# Altium project Frost5000Beta.PrjPcb
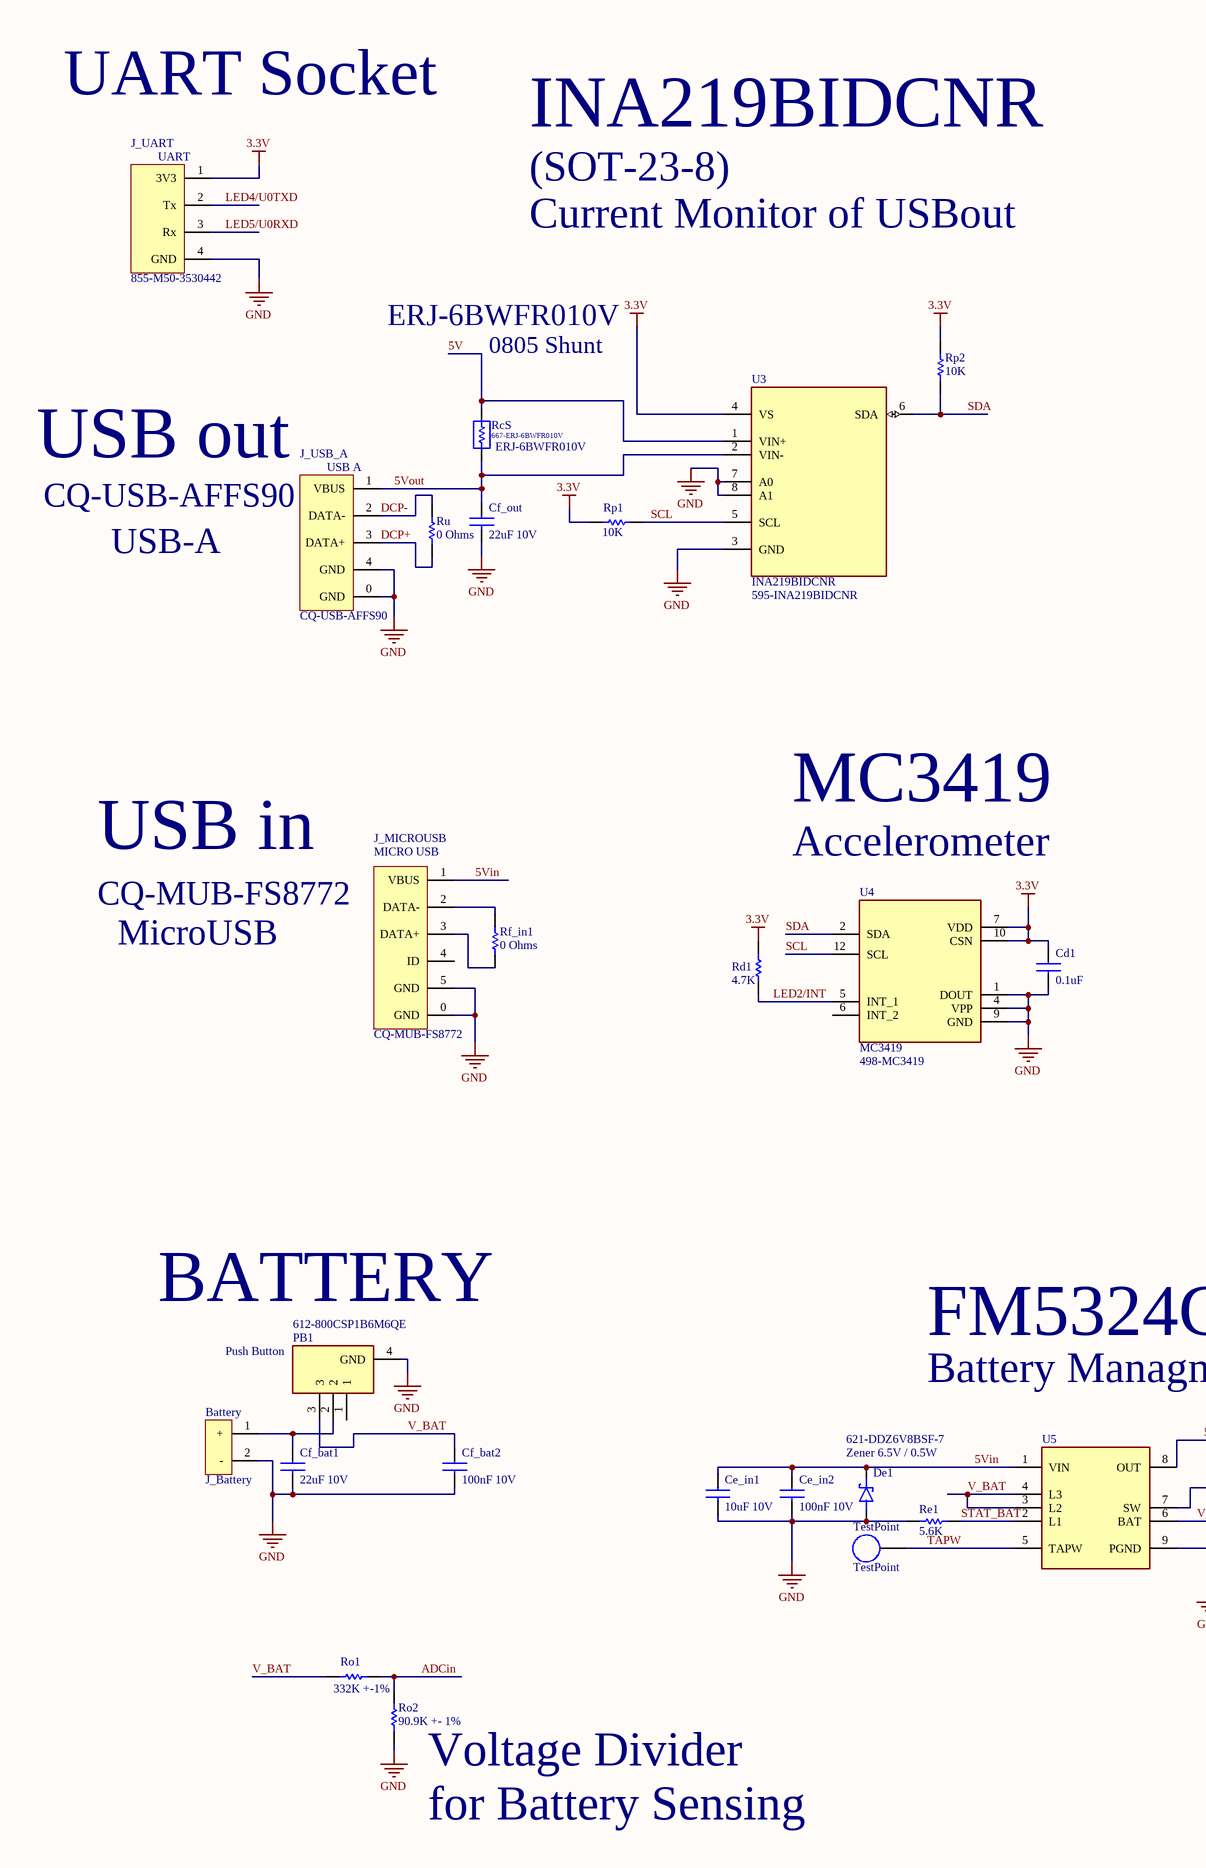
[diagram p0: Frost5000Beta_Sch.SchDoc, left]
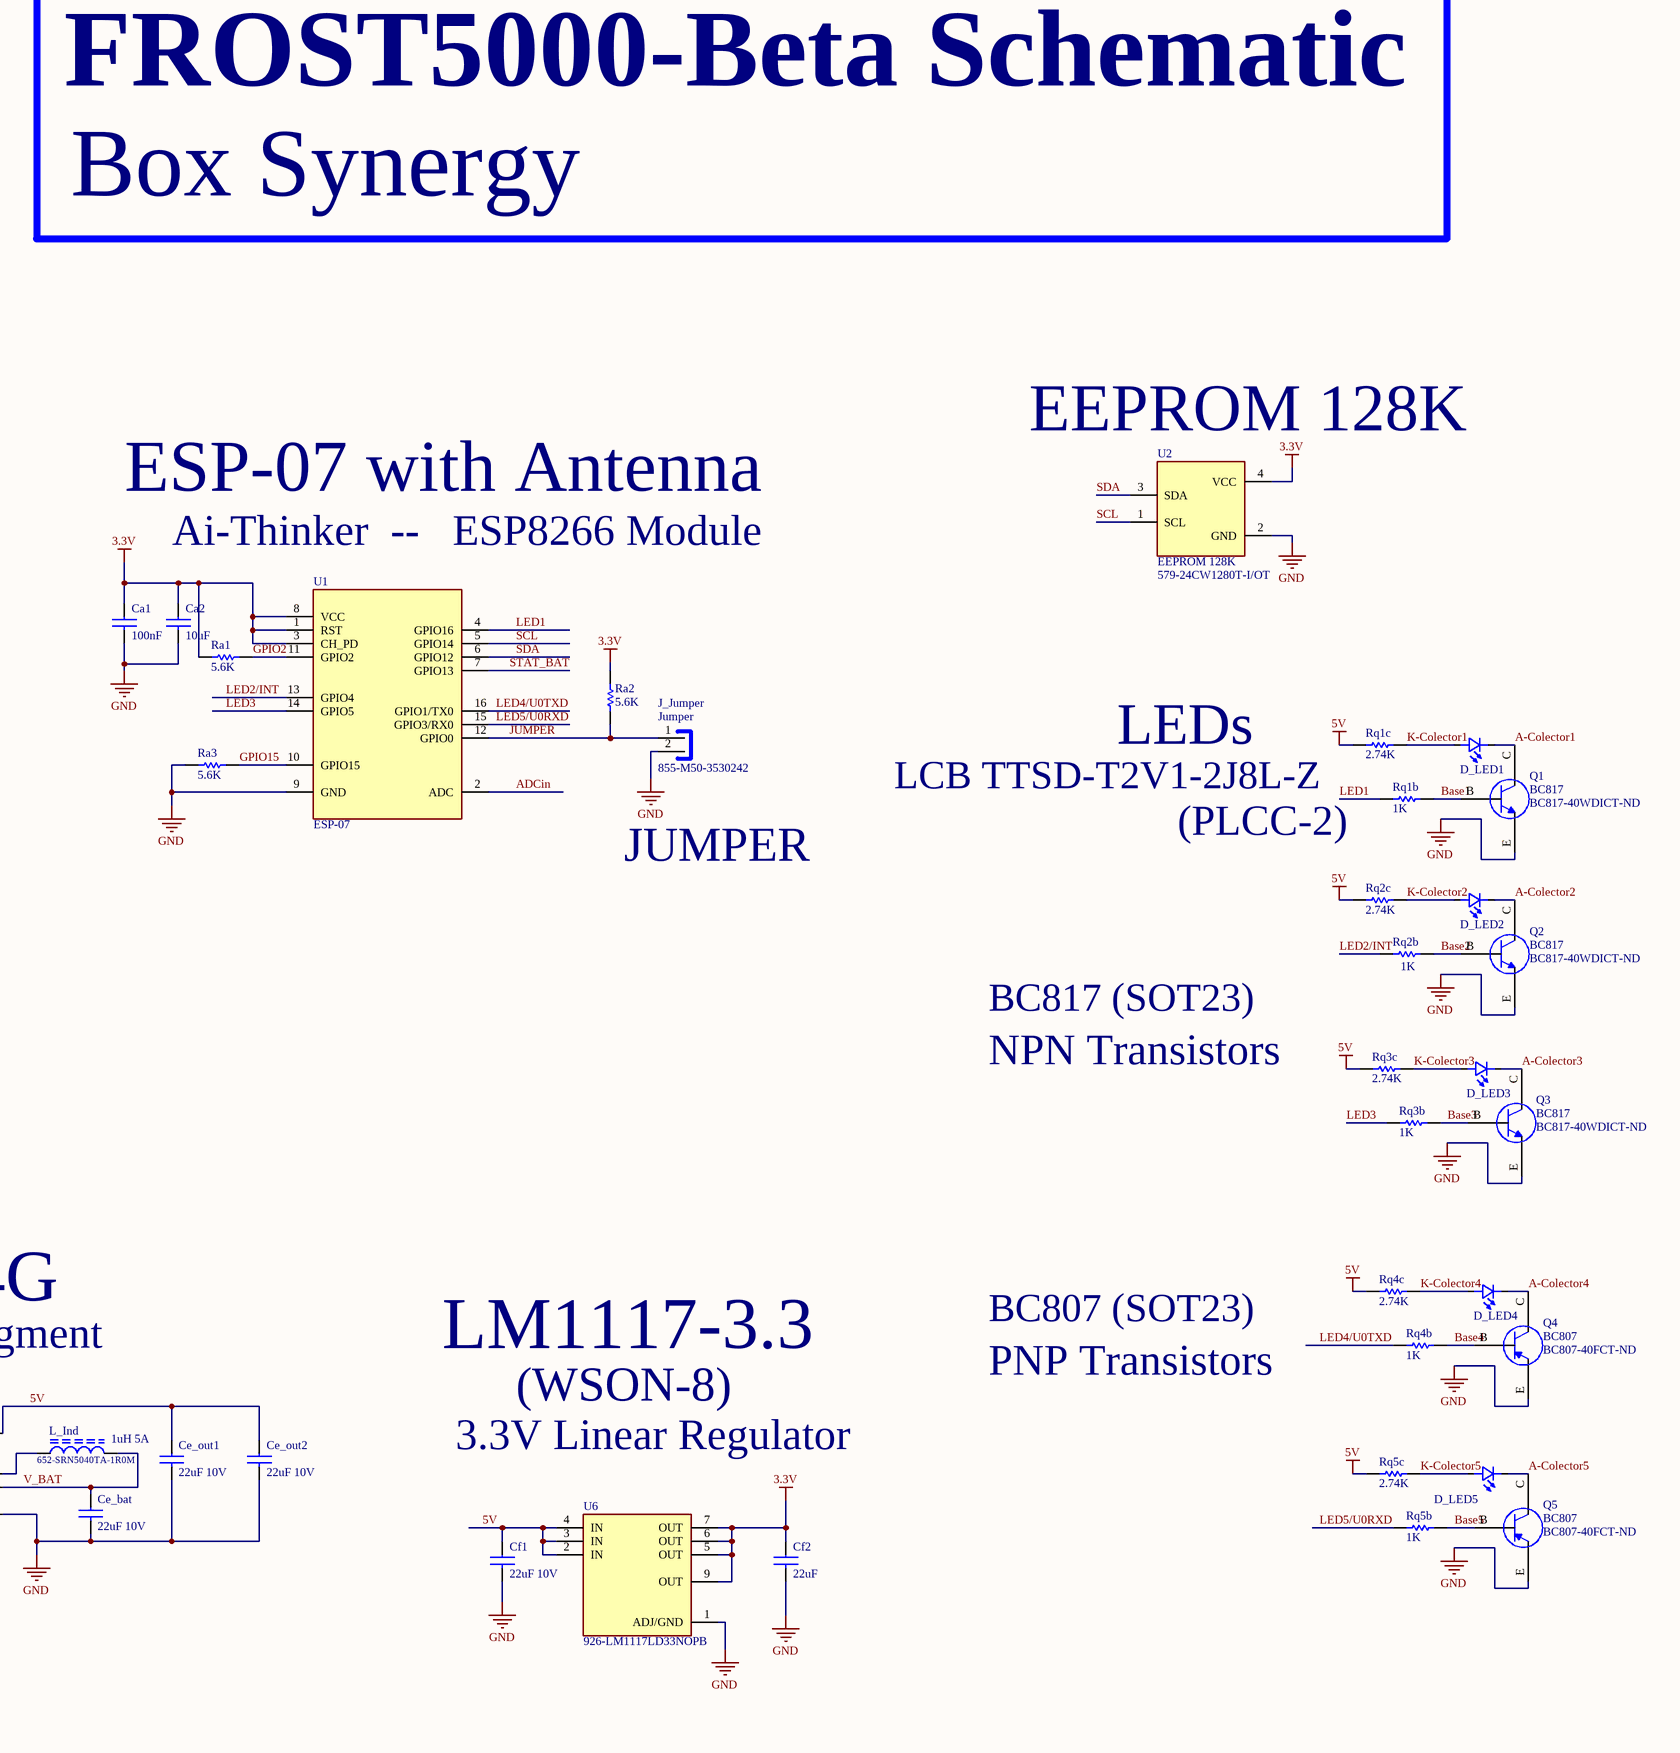
[diagram p1: Frost5000Beta_Sch.SchDoc, right]
1 sheet, 60 parts. Net scope: global (net labels, ports and power ports of the same name join across sheets).
Board file: Frost5000Beta_PCB.PcbDoc

## Sheet Frost5000Beta_Sch.SchDoc: Frost5000 Beta - V2.1
size A2; CheckedBy: Gonzalo Salinas; Author: Gustavo Belbruno; CompanyName: Box Synergy; DrawnBy: Gustavo Belbruno; Engineer: Gustavo Belbruno; Address4: Box Synergy; DocumentNumber: 2; Revision: 2.1; SheetNumber: 1; SheetTotal: 1

### Parts
Ca1  100nF  [CAP_0603]
Ca2  10uF  [CAP_1206]
Cd1  0.1uF  [CAP_0603]
Ce_bat  22uF 10V  [CAP_1206]
Ce_in1  10uF 10V  [CAP_1206]
Ce_in2  100nF 10V  [CAP_0603]
Ce_out1  22uF 10V  [CAP_1210]
Ce_out2  22uF 10V  [CAP_1206]
Cf1  22uF 10V  [CAP_0603]
Cf2  22uF  [CAP_0603]
Cf_bat1  22uF 10V  [CAP_1206]
Cf_bat2  100nF 10V  [CAP_0603]
Cf_out  22uF 10V  [CAP_1210]
D_LED1  LCB TTSD-T2V1-2J8L-Z  [LED_PLCC-2]  (value not drawn)
D_LED2  LCB TTSD-T2V1-2J8L-Z  [LED_PLCC-2]  (value not drawn)
D_LED3  LCB TTSD-T2V1-2J8L-Z  [LED_PLCC-2]  (value not drawn)
D_LED4  LCB TTSD-T2V1-2J8L-Z  [LED_PLCC-2]  (value not drawn)
D_LED5  LCB TTSD-T2V1-2J8L-Z  [LED_PLCC-2]  (value not drawn)
De1  Zener 6.5V / 0.5W  Supplier Part Number 1: 621-DDZ6V8BSF-7  [Zener-SOD323F]
J_Battery  Connx2_Battery  [Battery]  (value not drawn)
J_Jumper  Supplier Part Number 1: 855-M50-3530242  [JUMPER-1.27 mm]  (hidden comment: M50-3530242)
J_MICROUSB  CQ-MUB-FS8772  [MICRO USB]
J_UART  Supplier Part Number 1: 855-M50-3530442  [UART-1.27mm]  (hidden comment: M50-3530442)
J_USB_A  CQ-USB-AFFS90  [USB-A__IPX8]
L_Ind  1uH 5A  Supplier Part Number 1: 652-SRN5040TA-1R0M  [Inductor_SRN5040]
PB1  Push Button  Supplier Part Number 1: 612-800CSP1B6M6QE  [800C Switch]
Q1  BC817  Supplier Part Number 1: BC817-40WDICT-ND  [Transistor_SOT23-3]
Q2  BC817  Supplier Part Number 1: BC817-40WDICT-ND  [Transistor_SOT23-3]
Q3  BC817  Supplier Part Number 1: BC817-40WDICT-ND  [Transistor_SOT23-3]
Q4  BC807  Supplier Part Number 1: BC807-40FCT-ND  [Transistor_SOT23-3]
Q5  BC807  Supplier Part Number 1: BC807-40FCT-ND  [Transistor_SOT23-3]
Ra1  5.6K  [RES_0603]
Ra2  5.6K  [RES_0603]
Ra3  5.6K  [RES_0603]
RcS  ERJ-6BWFR010V  Supplier Part Number 1: 667-ERJ-6BWFR010V  [RES-SHUNT-0805]
Rd1  4.7K  [RES_0603]
Re1  5.6K  [RES_0603]
Rf_in1  0 Ohms  [RES_0603]
Ro1  332K +-1%  [RES_0603]
Ro2  90.9K +- 1%  [RES_0603]
Rp1  10K  [RES_0603]
Rp2  10K  [RES_0603]
Rq1b  1K  [RES_0603]
Rq1c  2.74K  [RES_0603]
Rq2b  1K  [RES_0603]
Rq2c  2.74K  [RES_0603]
Rq3b  1K  [RES_0603]
Rq3c  2.74K  [RES_0603]
Rq4b  1K  [RES_0603]
Rq4c  2.74K  [RES_0603]
Rq5b  1K  [RES_0603]
Rq5c  2.74K  [RES_0603]
Ru  0 Ohms  [RES_0603]
TestPoint  TestPoint  [TestPoint]  (no BOM)
U1  ESP-07  [ESP-07]
U2  EEPROM 128K  Supplier Part Number 1: 579-24CW1280T-I/OT  [24CW128]
U3  INA219BIDCNR  Supplier Part Number 1: 595-INA219BIDCNR  [INA219B SOT23]
U4  MC3419  Supplier Part Number 1: 498-MC3419  [MC3419]
U5  FM5324G  [SOP8]  (value not drawn)
U6  Supplier Part Number 1: 926-LM1117LD33NOPB  [LM1117-3.3-WSON-8]  (hidden comment: LM1117LD-3.3/NOPB)

### Nets
3.3V: Ca1.1 Ca2.1 Cd1.1 Cf2.1 J_UART.1(3V3) Ra1.2 Ra2.2 Rd1.1 Rp1.1 Rp2.1 U1.1(RST) U1.3(CH_PD) U1.8(VCC) U2.4(VCC) U3.4(VS) U4.7(VDD) U4.10(CSN) U6.5(OUT) U6.6(OUT) U6.7(OUT) U6.9(OUT)
5V: Ce_out1.1 Ce_out2.1 Cf1.1 RcS.2 Rq1c.2 Rq2c.2 Rq3c.2 Rq4c.2 Rq5c.2 U3.1(VIN+) U5.8(OUT) U6.2(IN) U6.3(IN) U6.4(IN)
GND: Ca1.2 Ca2.2 Cd1.2 Ce_bat.2 Ce_in1.2 Ce_in2.2 Ce_out1.2 Ce_out2.2 Cf1.2 Cf2.2 Cf_bat1.2 Cf_bat2.2 Cf_out.2 De1.A J_Battery.2(-) J_Jumper.2 J_MICROUSB.0(GND) J_MICROUSB.5(GND) J_UART.4(GND) J_USB_A.0(GND) J_USB_A.4(GND) PB1.4(GND) Q1.E Q2.E Q3.E Q4.E Q5.E Ra3.2 Re1.2 Ro2.1 U1.9(GND) U2.2(GND) U3.3(GND) U3.7(A0) U3.8(A1) U4.1(DOUT) U4.4(VPP) U4.9(GND) U5.9(PGND) U6.1(ADJ/GND)
5Vin: Ce_in1.1 Ce_in2.1 De1.C J_MICROUSB.1(VBUS) U5.1(VIN)
5Vout: Cf_out.1 J_USB_A.1(VBUS) RcS.1 U3.2(VIN-)
A-Colector1: D_LED1.1(K) Q1.C
A-Colector2: D_LED2.1(K) Q2.C
A-Colector3: D_LED3.1(K) Q3.C
A-Colector4: D_LED4.1(K) Q4.C
A-Colector5: D_LED5.1(K) Q5.C
ADCin: Ro1.2 Ro2.2 U1.2(ADC)
Base1: Q1.B Rq1b.1
Base2: Q2.B Rq2b.1
Base3: Q3.B Rq3b.1
Base4: Q4.B Rq4b.1
Base5: Q5.B Rq5b.1
DCP+: J_USB_A.3(DATA+) Ru.1
DCP-: J_USB_A.2(DATA-) Ru.2
GPIO2: Ra1.1 U1.11(GPIO2)
GPIO15: Ra3.1 U1.10(GPIO15)
JUMPER: J_Jumper.1 Ra2.1 U1.12(GPIO0)
K-Colector1: D_LED1.2(A) Rq1c.1
K-Colector2: D_LED2.2(A) Rq2c.1
K-Colector3: D_LED3.2(A) Rq3c.1
K-Colector4: D_LED4.2(A) Rq4c.1
K-Colector5: D_LED5.2(A) Rq5c.1
LED1: Rq1b.2 U1.4(GPIO16)
LED2/INT: Rd1.2 Rq2b.2 U1.13(GPIO4) U4.5(INT_1)
LED3: Rq3b.2 U1.14(GPIO5)
LED4/U0TXD: J_UART.2(Tx) Rq4b.2 U1.16(GPIO1/TX0)
LED5/U0RXD: J_UART.3(Rx) Rq5b.2 U1.15(GPIO3/RX0)
SCL: Rp1.2 U1.5(GPIO14) U2.1(SCL) U3.5(SCL) U4.12(SCL)
SDA: Rp2.2 U1.6(GPIO12) U2.3(SDA) U3.6(SDA) U4.2(SDA)
STAT_BAT: Re1.1 U1.7(GPIO13) U5.2(L1)
TAPW: TestPoint.1 U5.5(TAPW)
V_BAT: Ce_bat.1 Cf_bat2.1 L_Ind.1 PB1.3 Ro1.1 U5.3(L2) U5.4(L3) U5.6(BAT)
NetCf_bat1_1: Cf_bat1.1 J_Battery.1(+) PB1.2
NetJ_MICROUSB_2: J_MICROUSB.2(DATA-) Rf_in1.1
NetJ_MICROUSB_3: J_MICROUSB.3(DATA+) Rf_in1.2
NetL_Ind_2: L_Ind.2 U5.7(SW)

Not connected (* = marked no-connect by the designer): J_MICROUSB 4(ID); PB1 1; U4 6(INT_2)

### Notes on the sheet
- UART Socket
- INA219BIDCNR
- (SOT-23-8)
- FROST5000-Beta Schematic
- Current Monitor of USBout
- Box Synergy
- ERJ-6BWFR010V
- 0805 Shunt
- USB out
- CQ-USB-AFFS90
- ESP-07 with Antenna
- (near U2) EEPROM 128K
- USB-A
- Ai-Thinker  --   ESP8266 Module
- LEDs
- USB in
- Accelerometer
- MC3419
- LCB TTSD-T2V1-2J8L-Z
- CQ-MUB-FS8772
- JUMPER
- (PLCC-2)
- MicroUSB
- BC817 (SOT23)
- NPN Transistors
- (near PB1) BATTERY
- FM5324G
- Battery Managment
- LM1117-3.3
- BC807 (SOT23)
- (WSON-8)
- PNP Transistors
- 3.3V Linear Regulator
- (near Ro2) Voltage Divider
- for Battery Sensing
- Title
- Size:
- Date:
- File:
- A2
- Number:
- Time:
- Revision:
- Sheet
- of
- (in symbol Connx2_Battery) Battery
- (in symbol Connx4_UART) UART
- (in symbol MicroUSB) MICRO USB
- (in symbol USB-A 5V) USB A

### Library data of the parts
Ca1 Cd1 Ce_in2 Cf1 Cf2 Cf_bat2 = Cap_0603_Ceramic: Capac Ceramic SMD 0603
Ca2 Ce_bat Ce_in1 Ce_out2 Cf_bat1 = Cap_1206_Ceramic: Capac Ceramic SMD
Ce_out1 Cf_out = Cap_1210_Ceramic: Capac Ceramic SMD 1210
D_LED1-D_LED5 = LCB_TTSD: Blue LED PLCC-2; MF: Broadcom Limited; MP: HSMW-C191; SnapEDA_Link: https://www.snapeda.com/parts/HSMW-C191/Broadcom%20Limited/view-part/1840124/?ref=snap; Price: None; Value: *; Package: 0603 Broadcom; Availability: Unavailable
De1 = Zener: MF: Littelfuse; MP: SMF5.0AT1G; Value: *; Availability: Unavailable; Package: SOD-123 Littelfuse; Price: None; SnapEDA_Link: https://www.snapeda.com/parts/SMF5.0AT1G/Littelfuse/view-part/4502608/?ref=snap; Supplier 1: Mouser
J_Battery = Connx2_Battery: NO SOCKET
J_Jumper = Jumper: 1.27mm Pin Header 2x1; Supplier 1: Mouser
J_MICROUSB = MicroUSB: MicroUSB B-type Socket
J_UART = Connx4_UART: 1.27mm Pin Header 4x1; Supplier 1: Mouser
J_USB_A = USB-A 5V: USB-A Socket
L_Ind = Ind_SRN5040: Inductor_SRN5040; MF: Vishay Dale; Availability: Unavailable; Package: Nonstandard Vishay Dale; Value: *; Price: None; SnapEDA_Link: https://www.snapeda.com/parts/IHLP-2525CZ-01/Vishay%20Dale/view-part/561997/?ref=snap; Supplier 1: Mouser
PB1 = 800C: Push Button 800C; Supplier 1: Mouser
Q1-Q3 = BC817: Transistor NPN; Supplier 1: Digi-Key
Q4 Q5 = BC807: Transistor PNP; Supplier 1: Digi-Key
Ra1-Ra3 Rd1 Re1 Rf_in1 Ro1 Ro2 Rp1 Rp2 Rq1b Rq1c Rq2b Rq2c Rq3b Rq3c Rq4b Rq4c Rq5b Rq5c Ru = Res_0603: Resistor SMD; Published: 8-Jun-2000; LatestRevisionDate: 17-Jul-2002; LatestRevisionNote: Re-released for DXP Platform.; PackageReference: AXIAL-0.3; Publisher: Altium Limited; PackageDescription: Axial Device, Thru-Hole; 2 Leads; 0.3 in Pin Spacing
RcS = Shunt_0805: Shunt 0.01 Ohm 0.5W 1% SMD Resistor; Published: 8-Jun-2000; LatestRevisionDate: 17-Jul-2002; LatestRevisionNote: Re-released for DXP Platform.; PackageReference: AXIAL-0.3; Publisher: Altium Limited; PackageDescription: Axial Device, Thru-Hole; 2 Leads; 0.3 in Pin Spacing; Supplier 1: Mouser
U1 = ESP-07: ESP07 Module with Antenna Ai-Thinker; MP: AP65111AWU-7; MF: Diodes Inc.; Availability: Unavailable; SnapEDA_Link: https://www.snapeda.com/parts/AP65111AWU-7/Diodes%20Inc./view-part/1631258/?ref=snap; Price: None; Value: *; Package: TSOT-23-6 Diodes Inc.
U2 = 24CW1280T-I/OT: Supplier 1: Mouser
U3 = INA219BIDCNR: Current Monitor Regulator High-Side 10mA SOT-23-8; MF: Texas Instruments; SnapEDA_Link: https://www.snapeda.com/parts/INA219BIDCNR/Texas%20Instruments/view-part/870494/?ref=snap; MP: INA219BIDCNR; Value: *; Digi-Key_Part_Number: 296-46420-1-ND; Digi-Key_Purchase_URL: https://www.digikey.com.au/product-detail/en/texas-instruments/INA219BIDCNR/296-46420-1-ND/7033594?utm_source=snapeda&utm_medium=aggregator&utm_campaign=symbol; Package: SOT-23 Texas Instruments; Supplier 1: Mouser
U4 = MC3419: Accelerometer; MP: LSM303AGR; MF: STMicroelectronics; Availability: Unavailable; Price: None; Value: *; SnapEDA_Link: https://www.snapeda.com/parts/LSM303AGR/STMicroelectronics/view-part/3601838/?ref=snap; Package: VFLGA-12 STMicroelectronics; Supplier 1: Mouser
U5 = FM5324G: Power Battery Management IC; MP: LT1117IST-5#PBF; MF: Analog Devices; Value: *; Availability: Unavailable; Price: None; Package: SOT-223-3 Analog Devices; SnapEDA_Link: https://www.snapeda.com/parts/LT1117IST-5%23PBF/Analog%20Devices/view-part/4348177/?ref=snap
U6 = LM1117LD-3.3/NOPB: LDO Regulator Pos 3.3V 0.8A Texas - WSON8; MP: LT1117IST-5#PBF; MF: Analog Devices; Value: *; Availability: Unavailable; Price: None; Package: SOT-223-3 Analog Devices; SnapEDA_Link: https://www.snapeda.com/parts/LT1117IST-5%23PBF/Analog%20Devices/view-part/4348177/?ref=snap; Supplier 1: Mouser